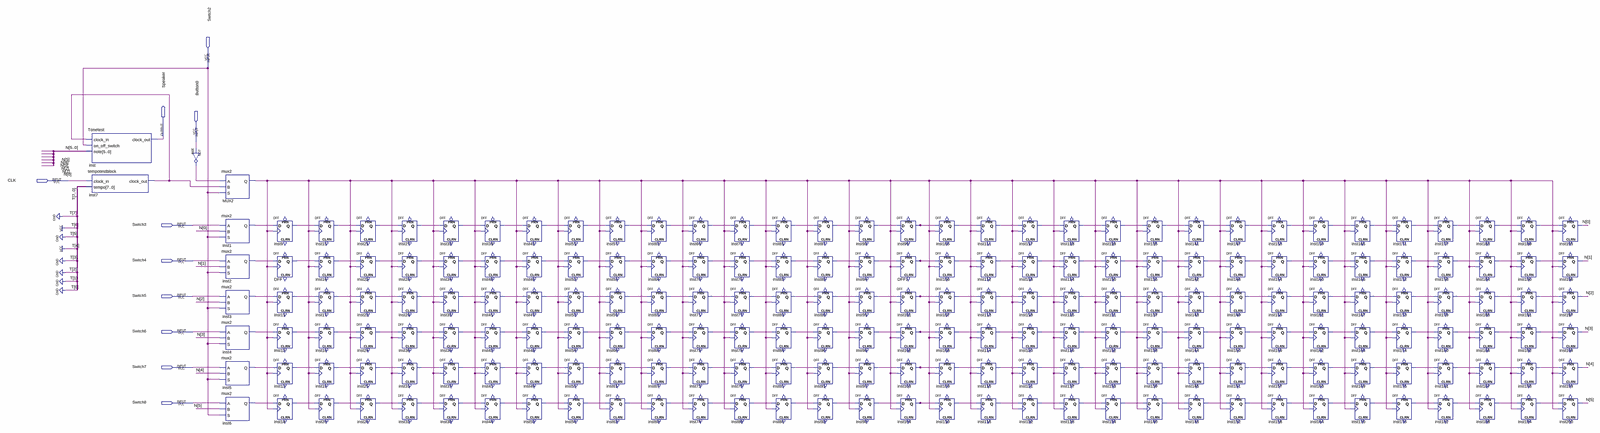
[diagram p0: schematic sheet, whole]
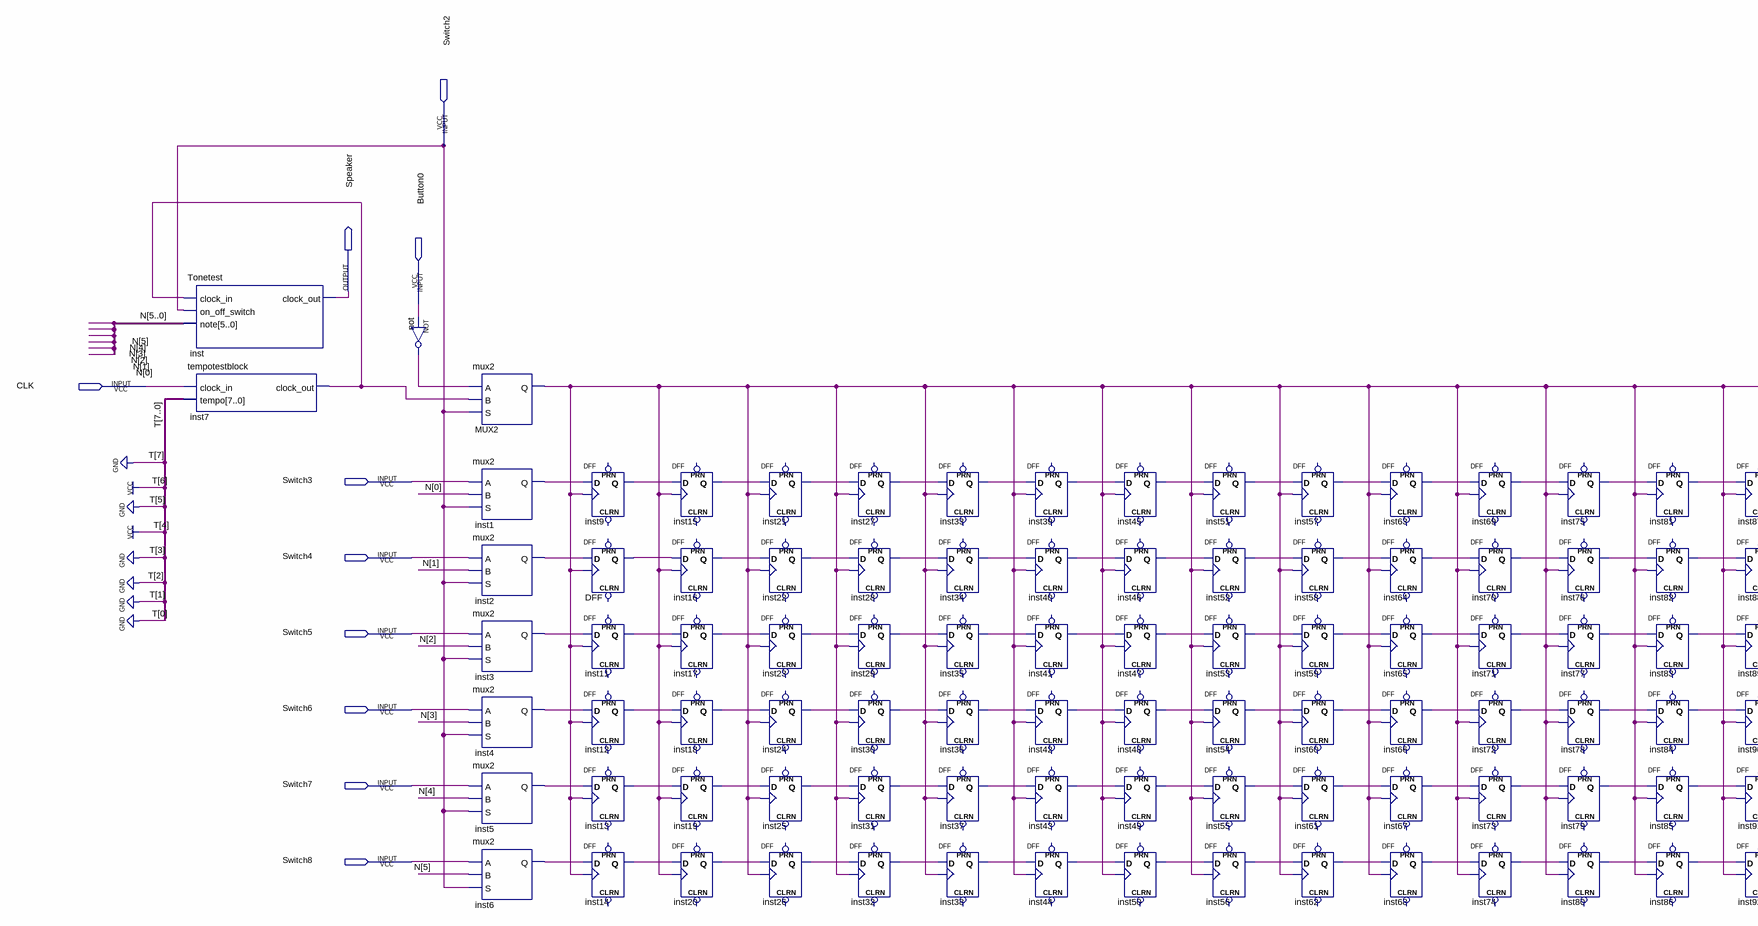
[diagram p1: schematic sheet, left part]
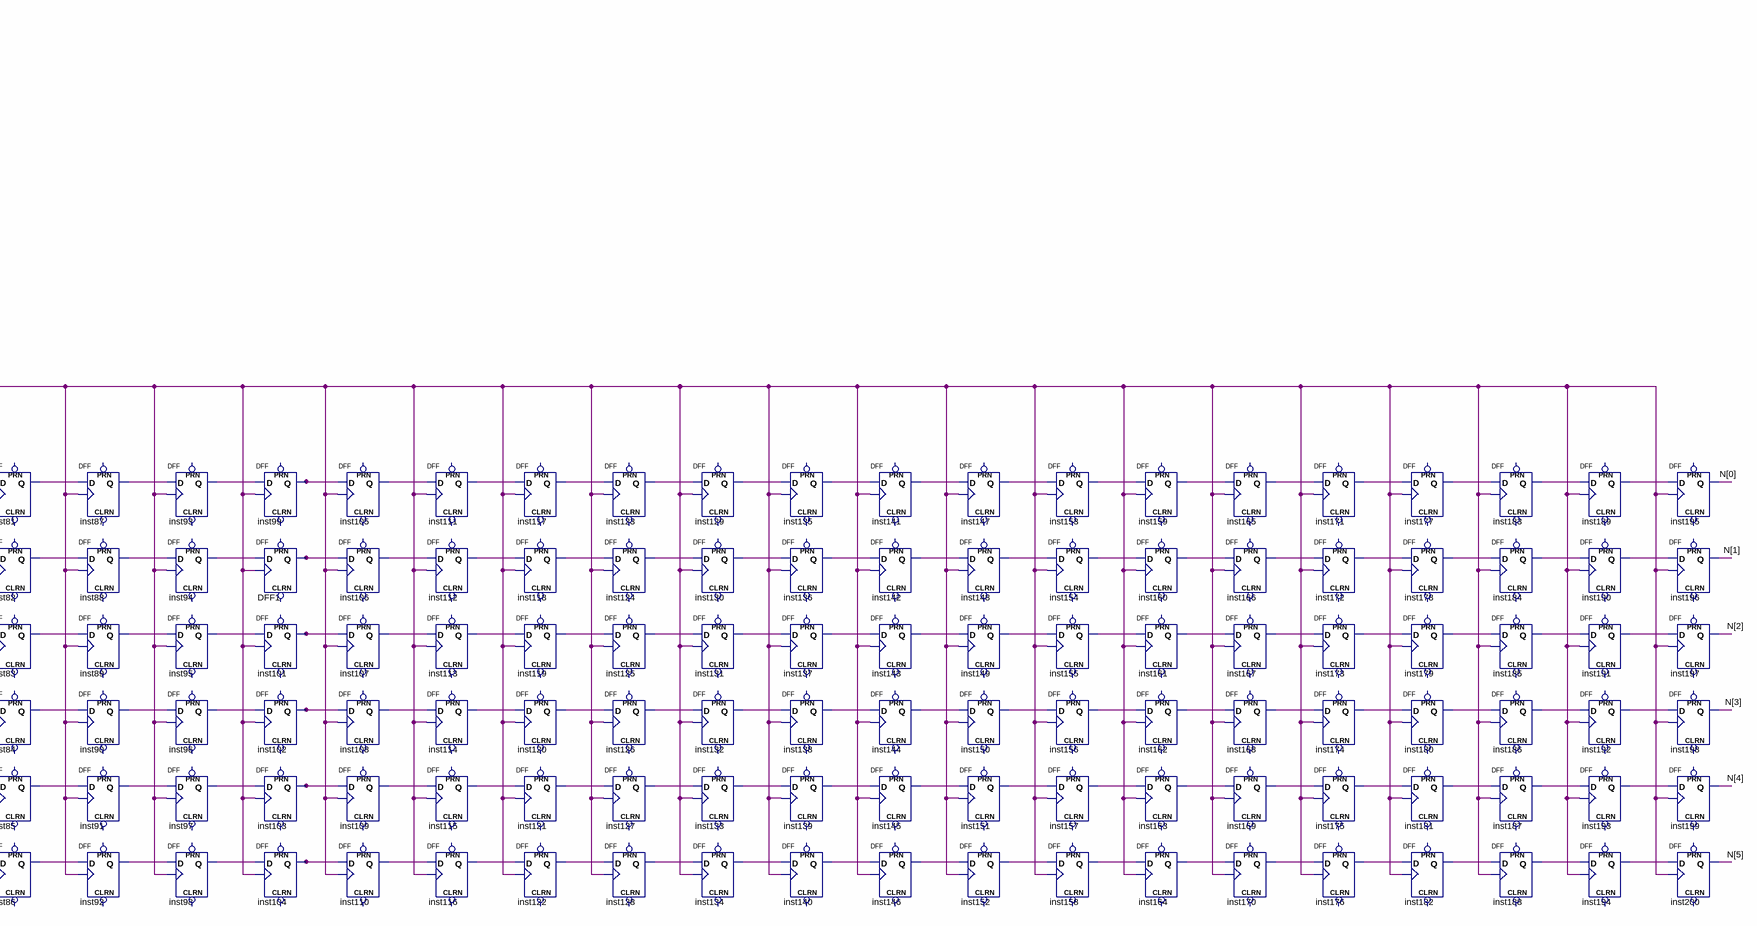
[diagram p2: schematic sheet, right part]
// Quartus schematic musicPlayer.bdf as structural Verilog: 202 symbols, 10 pins
module musicPlayer (
  input  Switch2,
  input  Button0,
  input  CLK,
  input  Switch3,
  input  Switch4,
  input  Switch5,
  input  Switch6,
  input  Switch7,
  input  Switch8,
  output Speaker
);

  wire DFF1_q, DFF_q, inst1_q, inst2_q, inst3_q, inst4_q, inst5_q, inst6_q, inst7_clock_out, inst9_q,
       inst11_q, inst12_q, inst13_q, inst14_q, inst15_q, inst16_q, inst17_q, inst18_q, inst19_q, inst20_q,
       inst21_q, inst22_q, inst23_q, inst24_q, inst25_q, inst26_q, inst27_q, inst28_q, inst29_q, inst30_q,
       inst31_q, inst32_q, inst33_q, inst34_q, inst35_q, inst36_q, inst37_q, inst38_q, inst39_q, inst40_q,
       inst41_q, inst42_q, inst43_q, inst44_q, inst45_q, inst46_q, inst47_q, inst48_q, inst49_q, inst50_q,
       inst51_q, inst52_q, inst53_q, inst54_q, inst55_q, inst56_q, inst57_q, inst58_q, inst59_q, inst60_q,
       inst61_q, inst62_q, inst63_q, inst64_q, inst65_q, inst66_q, inst67_q, inst68_q, inst69_q, inst70_q,
       inst71_q, inst72_q, inst73_q, inst74_q, inst75_q, inst76_q, inst77_q, inst78_q, inst79_q, inst80_q,
       inst81_q, inst82_q, inst83_q, inst84_q, inst85_q, inst86_q, inst87_q, inst88_q, inst89_q, inst90_q,
       inst91_q, inst92_q, inst93_q, inst94_q, inst95_q, inst96_q, inst97_q, inst98_q, inst99_q, inst101_q,
       inst102_q, inst103_q, inst104_q, inst105_q, inst106_q, inst107_q, inst108_q, inst109_q, inst110_q,
       inst111_q, inst112_q, inst113_q, inst114_q, inst115_q, inst116_q, inst117_q, inst118_q, inst119_q,
       inst120_q, inst121_q, inst122_q, inst123_q, inst124_q, inst125_q, inst126_q, inst127_q, inst128_q,
       inst129_q, inst130_q, inst131_q, inst132_q, inst133_q, inst134_q, inst135_q, inst136_q, inst137_q,
       inst138_q, inst139_q, inst140_q, inst141_q, inst142_q, inst143_q, inst144_q, inst145_q, inst146_q,
       inst147_q, inst148_q, inst149_q, inst150_q, inst151_q, inst152_q, inst153_q, inst154_q, inst155_q,
       inst156_q, inst157_q, inst158_q, inst159_q, inst160_q, inst161_q, inst162_q, inst163_q, inst164_q,
       inst165_q, inst166_q, inst167_q, inst168_q, inst169_q, inst170_q, inst171_q, inst172_q, inst173_q,
       inst174_q, inst175_q, inst176_q, inst177_q, inst178_q, inst179_q, inst180_q, inst181_q, inst182_q,
       inst183_q, inst184_q, inst185_q, inst186_q, inst187_q, inst188_q, inst189_q, inst190_q, inst191_q,
       inst192_q, inst193_q, inst194_q, MUX2_q, not_out;
  wire [5:0] N;

  Tonetest inst (.clock_in(inst7_clock_out), .on_off_switch(Switch2), .note(N), .clock_out(Speaker));
  tempotestblock inst7 (.clock_in(CLK), .tempo(8'b01010000), .clock_out(inst7_clock_out));
  not \not  (not_out, Button0);
  mux2 MUX2 (.A(not_out), .B(inst7_clock_out), .S(Switch2), .Q(MUX2_q));
  mux2 inst1 (.A(Switch3), .B(N[0]), .S(Switch2), .Q(inst1_q));
  mux2 inst2 (.A(Switch4), .B(N[1]), .S(Switch2), .Q(inst2_q));
  mux2 inst3 (.A(Switch5), .B(N[2]), .S(Switch2), .Q(inst3_q));
  mux2 inst4 (.A(Switch6), .B(N[3]), .S(Switch2), .Q(inst4_q));
  mux2 inst5 (.A(Switch7), .B(N[4]), .S(Switch2), .Q(inst5_q));
  mux2 inst6 (.A(Switch8), .B(N[5]), .S(Switch2), .Q(inst6_q));
  DFF inst9 (.CLK(MUX2_q), .D(inst1_q), .Q(inst9_q));  // open: CLRN, PRN
  DFF DFF (.CLK(MUX2_q), .D(inst2_q), .Q(DFF_q));  // open: CLRN, PRN
  DFF inst11 (.CLK(MUX2_q), .D(inst3_q), .Q(inst11_q));  // open: CLRN, PRN
  DFF inst12 (.CLK(MUX2_q), .D(inst4_q), .Q(inst12_q));  // open: CLRN, PRN
  DFF inst13 (.CLK(MUX2_q), .D(inst5_q), .Q(inst13_q));  // open: CLRN, PRN
  DFF inst14 (.CLK(MUX2_q), .D(inst6_q), .Q(inst14_q));  // open: CLRN, PRN
  DFF inst15 (.CLK(MUX2_q), .D(inst9_q), .Q(inst15_q));  // open: CLRN, PRN
  DFF inst16 (.CLK(MUX2_q), .D(DFF_q), .Q(inst16_q));  // open: CLRN, PRN
  DFF inst17 (.CLK(MUX2_q), .D(inst11_q), .Q(inst17_q));  // open: CLRN, PRN
  DFF inst18 (.CLK(MUX2_q), .D(inst12_q), .Q(inst18_q));  // open: CLRN, PRN
  DFF inst19 (.CLK(MUX2_q), .D(inst13_q), .Q(inst19_q));  // open: CLRN, PRN
  DFF inst20 (.CLK(MUX2_q), .D(inst14_q), .Q(inst20_q));  // open: CLRN, PRN
  DFF inst21 (.CLK(MUX2_q), .D(inst15_q), .Q(inst21_q));  // open: CLRN, PRN
  DFF inst22 (.CLK(MUX2_q), .D(inst16_q), .Q(inst22_q));  // open: CLRN, PRN
  DFF inst23 (.CLK(MUX2_q), .D(inst17_q), .Q(inst23_q));  // open: CLRN, PRN
  DFF inst24 (.CLK(MUX2_q), .D(inst18_q), .Q(inst24_q));  // open: CLRN, PRN
  DFF inst25 (.CLK(MUX2_q), .D(inst19_q), .Q(inst25_q));  // open: CLRN, PRN
  DFF inst26 (.CLK(MUX2_q), .D(inst20_q), .Q(inst26_q));  // open: CLRN, PRN
  DFF inst27 (.CLK(MUX2_q), .D(inst21_q), .Q(inst27_q));  // open: CLRN, PRN
  DFF inst28 (.CLK(MUX2_q), .D(inst22_q), .Q(inst28_q));  // open: CLRN, PRN
  DFF inst29 (.CLK(MUX2_q), .D(inst23_q), .Q(inst29_q));  // open: CLRN, PRN
  DFF inst30 (.CLK(MUX2_q), .D(inst24_q), .Q(inst30_q));  // open: CLRN, PRN
  DFF inst31 (.CLK(MUX2_q), .D(inst25_q), .Q(inst31_q));  // open: CLRN, PRN
  DFF inst32 (.CLK(MUX2_q), .D(inst26_q), .Q(inst32_q));  // open: CLRN, PRN
  DFF inst33 (.CLK(MUX2_q), .D(inst27_q), .Q(inst33_q));  // open: CLRN, PRN
  DFF inst34 (.CLK(MUX2_q), .D(inst28_q), .Q(inst34_q));  // open: CLRN, PRN
  DFF inst35 (.CLK(MUX2_q), .D(inst29_q), .Q(inst35_q));  // open: CLRN, PRN
  DFF inst36 (.CLK(MUX2_q), .D(inst30_q), .Q(inst36_q));  // open: CLRN, PRN
  DFF inst37 (.CLK(MUX2_q), .D(inst31_q), .Q(inst37_q));  // open: CLRN, PRN
  DFF inst38 (.CLK(MUX2_q), .D(inst32_q), .Q(inst38_q));  // open: CLRN, PRN
  DFF inst39 (.CLK(MUX2_q), .D(inst33_q), .Q(inst39_q));  // open: CLRN, PRN
  DFF inst40 (.CLK(MUX2_q), .D(inst34_q), .Q(inst40_q));  // open: CLRN, PRN
  DFF inst41 (.CLK(MUX2_q), .D(inst35_q), .Q(inst41_q));  // open: CLRN, PRN
  DFF inst42 (.CLK(MUX2_q), .D(inst36_q), .Q(inst42_q));  // open: CLRN, PRN
  DFF inst43 (.CLK(MUX2_q), .D(inst37_q), .Q(inst43_q));  // open: CLRN, PRN
  DFF inst44 (.CLK(MUX2_q), .D(inst38_q), .Q(inst44_q));  // open: CLRN, PRN
  DFF inst45 (.CLK(MUX2_q), .D(inst39_q), .Q(inst45_q));  // open: CLRN, PRN
  DFF inst46 (.CLK(MUX2_q), .D(inst40_q), .Q(inst46_q));  // open: CLRN, PRN
  DFF inst47 (.CLK(MUX2_q), .D(inst41_q), .Q(inst47_q));  // open: CLRN, PRN
  DFF inst48 (.CLK(MUX2_q), .D(inst42_q), .Q(inst48_q));  // open: CLRN, PRN
  DFF inst49 (.CLK(MUX2_q), .D(inst43_q), .Q(inst49_q));  // open: CLRN, PRN
  DFF inst50 (.CLK(MUX2_q), .D(inst44_q), .Q(inst50_q));  // open: CLRN, PRN
  DFF inst51 (.CLK(MUX2_q), .D(inst45_q), .Q(inst51_q));  // open: CLRN, PRN
  DFF inst52 (.CLK(MUX2_q), .D(inst46_q), .Q(inst52_q));  // open: CLRN, PRN
  DFF inst53 (.CLK(MUX2_q), .D(inst47_q), .Q(inst53_q));  // open: CLRN, PRN
  DFF inst54 (.CLK(MUX2_q), .D(inst48_q), .Q(inst54_q));  // open: CLRN, PRN
  DFF inst55 (.CLK(MUX2_q), .D(inst49_q), .Q(inst55_q));  // open: CLRN, PRN
  DFF inst56 (.CLK(MUX2_q), .D(inst50_q), .Q(inst56_q));  // open: CLRN, PRN
  DFF inst57 (.CLK(MUX2_q), .D(inst51_q), .Q(inst57_q));  // open: CLRN, PRN
  DFF inst58 (.CLK(MUX2_q), .D(inst52_q), .Q(inst58_q));  // open: CLRN, PRN
  DFF inst59 (.CLK(MUX2_q), .D(inst53_q), .Q(inst59_q));  // open: CLRN, PRN
  DFF inst60 (.CLK(MUX2_q), .D(inst54_q), .Q(inst60_q));  // open: CLRN, PRN
  DFF inst61 (.CLK(MUX2_q), .D(inst55_q), .Q(inst61_q));  // open: CLRN, PRN
  DFF inst62 (.CLK(MUX2_q), .D(inst56_q), .Q(inst62_q));  // open: CLRN, PRN
  DFF inst63 (.CLK(MUX2_q), .D(inst57_q), .Q(inst63_q));  // open: CLRN, PRN
  DFF inst64 (.CLK(MUX2_q), .D(inst58_q), .Q(inst64_q));  // open: CLRN, PRN
  DFF inst65 (.CLK(MUX2_q), .D(inst59_q), .Q(inst65_q));  // open: CLRN, PRN
  DFF inst66 (.CLK(MUX2_q), .D(inst60_q), .Q(inst66_q));  // open: CLRN, PRN
  DFF inst67 (.CLK(MUX2_q), .D(inst61_q), .Q(inst67_q));  // open: CLRN, PRN
  DFF inst68 (.CLK(MUX2_q), .D(inst62_q), .Q(inst68_q));  // open: CLRN, PRN
  DFF inst69 (.CLK(MUX2_q), .D(inst63_q), .Q(inst69_q));  // open: CLRN, PRN
  DFF inst70 (.CLK(MUX2_q), .D(inst64_q), .Q(inst70_q));  // open: CLRN, PRN
  DFF inst71 (.CLK(MUX2_q), .D(inst65_q), .Q(inst71_q));  // open: CLRN, PRN
  DFF inst72 (.CLK(MUX2_q), .D(inst66_q), .Q(inst72_q));  // open: CLRN, PRN
  DFF inst73 (.CLK(MUX2_q), .D(inst67_q), .Q(inst73_q));  // open: CLRN, PRN
  DFF inst74 (.CLK(MUX2_q), .D(inst68_q), .Q(inst74_q));  // open: CLRN, PRN
  DFF inst75 (.CLK(MUX2_q), .D(inst69_q), .Q(inst75_q));  // open: CLRN, PRN
  DFF inst76 (.CLK(MUX2_q), .D(inst70_q), .Q(inst76_q));  // open: CLRN, PRN
  DFF inst77 (.CLK(MUX2_q), .D(inst71_q), .Q(inst77_q));  // open: CLRN, PRN
  DFF inst78 (.CLK(MUX2_q), .D(inst72_q), .Q(inst78_q));  // open: CLRN, PRN
  DFF inst79 (.CLK(MUX2_q), .D(inst73_q), .Q(inst79_q));  // open: CLRN, PRN
  DFF inst80 (.CLK(MUX2_q), .D(inst74_q), .Q(inst80_q));  // open: CLRN, PRN
  DFF inst81 (.CLK(MUX2_q), .D(inst75_q), .Q(inst81_q));  // open: CLRN, PRN
  DFF inst82 (.CLK(MUX2_q), .D(inst76_q), .Q(inst82_q));  // open: CLRN, PRN
  DFF inst83 (.CLK(MUX2_q), .D(inst77_q), .Q(inst83_q));  // open: CLRN, PRN
  DFF inst84 (.CLK(MUX2_q), .D(inst78_q), .Q(inst84_q));  // open: CLRN, PRN
  DFF inst85 (.CLK(MUX2_q), .D(inst79_q), .Q(inst85_q));  // open: CLRN, PRN
  DFF inst86 (.CLK(MUX2_q), .D(inst80_q), .Q(inst86_q));  // open: CLRN, PRN
  DFF inst87 (.CLK(MUX2_q), .D(inst81_q), .Q(inst87_q));  // open: CLRN, PRN
  DFF inst88 (.CLK(MUX2_q), .D(inst82_q), .Q(inst88_q));  // open: CLRN, PRN
  DFF inst89 (.CLK(MUX2_q), .D(inst83_q), .Q(inst89_q));  // open: CLRN, PRN
  DFF inst90 (.CLK(MUX2_q), .D(inst84_q), .Q(inst90_q));  // open: CLRN, PRN
  DFF inst91 (.CLK(MUX2_q), .D(inst85_q), .Q(inst91_q));  // open: CLRN, PRN
  DFF inst92 (.CLK(MUX2_q), .D(inst86_q), .Q(inst92_q));  // open: CLRN, PRN
  DFF inst93 (.CLK(MUX2_q), .D(inst87_q), .Q(inst93_q));  // open: CLRN, PRN
  DFF inst94 (.CLK(MUX2_q), .D(inst88_q), .Q(inst94_q));  // open: CLRN, PRN
  DFF inst95 (.CLK(MUX2_q), .D(inst89_q), .Q(inst95_q));  // open: CLRN, PRN
  DFF inst96 (.CLK(MUX2_q), .D(inst90_q), .Q(inst96_q));  // open: CLRN, PRN
  DFF inst97 (.CLK(MUX2_q), .D(inst91_q), .Q(inst97_q));  // open: CLRN, PRN
  DFF inst98 (.CLK(MUX2_q), .D(inst92_q), .Q(inst98_q));  // open: CLRN, PRN
  DFF inst99 (.CLK(MUX2_q), .D(inst93_q), .Q(inst99_q));  // open: CLRN, PRN
  DFF DFF1 (.CLK(MUX2_q), .D(inst94_q), .Q(DFF1_q));  // open: CLRN, PRN
  DFF inst101 (.CLK(MUX2_q), .D(inst95_q), .Q(inst101_q));  // open: CLRN, PRN
  DFF inst102 (.CLK(MUX2_q), .D(inst96_q), .Q(inst102_q));  // open: CLRN, PRN
  DFF inst103 (.CLK(MUX2_q), .D(inst97_q), .Q(inst103_q));  // open: CLRN, PRN
  DFF inst104 (.CLK(MUX2_q), .D(inst98_q), .Q(inst104_q));  // open: CLRN, PRN
  DFF inst105 (.CLK(MUX2_q), .D(inst99_q), .Q(inst105_q));  // open: CLRN, PRN
  DFF inst106 (.CLK(MUX2_q), .D(DFF1_q), .Q(inst106_q));  // open: CLRN, PRN
  DFF inst107 (.CLK(MUX2_q), .D(inst101_q), .Q(inst107_q));  // open: CLRN, PRN
  DFF inst108 (.CLK(MUX2_q), .D(inst102_q), .Q(inst108_q));  // open: CLRN, PRN
  DFF inst109 (.CLK(MUX2_q), .D(inst103_q), .Q(inst109_q));  // open: CLRN, PRN
  DFF inst110 (.CLK(MUX2_q), .D(inst104_q), .Q(inst110_q));  // open: CLRN, PRN
  DFF inst111 (.CLK(MUX2_q), .D(inst105_q), .Q(inst111_q));  // open: CLRN, PRN
  DFF inst112 (.CLK(MUX2_q), .D(inst106_q), .Q(inst112_q));  // open: CLRN, PRN
  DFF inst113 (.CLK(MUX2_q), .D(inst107_q), .Q(inst113_q));  // open: CLRN, PRN
  DFF inst114 (.CLK(MUX2_q), .D(inst108_q), .Q(inst114_q));  // open: CLRN, PRN
  DFF inst115 (.CLK(MUX2_q), .D(inst109_q), .Q(inst115_q));  // open: CLRN, PRN
  DFF inst116 (.CLK(MUX2_q), .D(inst110_q), .Q(inst116_q));  // open: CLRN, PRN
  DFF inst117 (.CLK(MUX2_q), .D(inst111_q), .Q(inst117_q));  // open: CLRN, PRN
  DFF inst118 (.CLK(MUX2_q), .D(inst112_q), .Q(inst118_q));  // open: CLRN, PRN
  DFF inst119 (.CLK(MUX2_q), .D(inst113_q), .Q(inst119_q));  // open: CLRN, PRN
  DFF inst120 (.CLK(MUX2_q), .D(inst114_q), .Q(inst120_q));  // open: CLRN, PRN
  DFF inst121 (.CLK(MUX2_q), .D(inst115_q), .Q(inst121_q));  // open: CLRN, PRN
  DFF inst122 (.CLK(MUX2_q), .D(inst116_q), .Q(inst122_q));  // open: CLRN, PRN
  DFF inst123 (.CLK(MUX2_q), .D(inst117_q), .Q(inst123_q));  // open: CLRN, PRN
  DFF inst124 (.CLK(MUX2_q), .D(inst118_q), .Q(inst124_q));  // open: CLRN, PRN
  DFF inst125 (.CLK(MUX2_q), .D(inst119_q), .Q(inst125_q));  // open: CLRN, PRN
  DFF inst126 (.CLK(MUX2_q), .D(inst120_q), .Q(inst126_q));  // open: CLRN, PRN
  DFF inst127 (.CLK(MUX2_q), .D(inst121_q), .Q(inst127_q));  // open: CLRN, PRN
  DFF inst128 (.CLK(MUX2_q), .D(inst122_q), .Q(inst128_q));  // open: CLRN, PRN
  DFF inst129 (.CLK(MUX2_q), .D(inst123_q), .Q(inst129_q));  // open: CLRN, PRN
  DFF inst130 (.CLK(MUX2_q), .D(inst124_q), .Q(inst130_q));  // open: CLRN, PRN
  DFF inst131 (.CLK(MUX2_q), .D(inst125_q), .Q(inst131_q));  // open: CLRN, PRN
  DFF inst132 (.CLK(MUX2_q), .D(inst126_q), .Q(inst132_q));  // open: CLRN, PRN
  DFF inst133 (.CLK(MUX2_q), .D(inst127_q), .Q(inst133_q));  // open: CLRN, PRN
  DFF inst134 (.CLK(MUX2_q), .D(inst128_q), .Q(inst134_q));  // open: CLRN, PRN
  DFF inst135 (.CLK(MUX2_q), .D(inst129_q), .Q(inst135_q));  // open: CLRN, PRN
  DFF inst136 (.CLK(MUX2_q), .D(inst130_q), .Q(inst136_q));  // open: CLRN, PRN
  DFF inst137 (.CLK(MUX2_q), .D(inst131_q), .Q(inst137_q));  // open: CLRN, PRN
  DFF inst138 (.CLK(MUX2_q), .D(inst132_q), .Q(inst138_q));  // open: CLRN, PRN
  DFF inst139 (.CLK(MUX2_q), .D(inst133_q), .Q(inst139_q));  // open: CLRN, PRN
  DFF inst140 (.CLK(MUX2_q), .D(inst134_q), .Q(inst140_q));  // open: CLRN, PRN
  DFF inst141 (.CLK(MUX2_q), .D(inst135_q), .Q(inst141_q));  // open: CLRN, PRN
  DFF inst142 (.CLK(MUX2_q), .D(inst136_q), .Q(inst142_q));  // open: CLRN, PRN
  DFF inst143 (.CLK(MUX2_q), .D(inst137_q), .Q(inst143_q));  // open: CLRN, PRN
  DFF inst144 (.CLK(MUX2_q), .D(inst138_q), .Q(inst144_q));  // open: CLRN, PRN
  DFF inst145 (.CLK(MUX2_q), .D(inst139_q), .Q(inst145_q));  // open: CLRN, PRN
  DFF inst146 (.CLK(MUX2_q), .D(inst140_q), .Q(inst146_q));  // open: CLRN, PRN
  DFF inst147 (.CLK(MUX2_q), .D(inst141_q), .Q(inst147_q));  // open: CLRN, PRN
  DFF inst148 (.CLK(MUX2_q), .D(inst142_q), .Q(inst148_q));  // open: CLRN, PRN
  DFF inst149 (.CLK(MUX2_q), .D(inst143_q), .Q(inst149_q));  // open: CLRN, PRN
  DFF inst150 (.CLK(MUX2_q), .D(inst144_q), .Q(inst150_q));  // open: CLRN, PRN
  DFF inst151 (.CLK(MUX2_q), .D(inst145_q), .Q(inst151_q));  // open: CLRN, PRN
  DFF inst152 (.CLK(MUX2_q), .D(inst146_q), .Q(inst152_q));  // open: CLRN, PRN
  DFF inst153 (.CLK(MUX2_q), .D(inst147_q), .Q(inst153_q));  // open: CLRN, PRN
  DFF inst154 (.CLK(MUX2_q), .D(inst148_q), .Q(inst154_q));  // open: CLRN, PRN
  DFF inst155 (.CLK(MUX2_q), .D(inst149_q), .Q(inst155_q));  // open: CLRN, PRN
  DFF inst156 (.CLK(MUX2_q), .D(inst150_q), .Q(inst156_q));  // open: CLRN, PRN
  DFF inst157 (.CLK(MUX2_q), .D(inst151_q), .Q(inst157_q));  // open: CLRN, PRN
  DFF inst158 (.CLK(MUX2_q), .D(inst152_q), .Q(inst158_q));  // open: CLRN, PRN
  DFF inst159 (.CLK(MUX2_q), .D(inst153_q), .Q(inst159_q));  // open: CLRN, PRN
  DFF inst160 (.CLK(MUX2_q), .D(inst154_q), .Q(inst160_q));  // open: CLRN, PRN
  DFF inst161 (.CLK(MUX2_q), .D(inst155_q), .Q(inst161_q));  // open: CLRN, PRN
  DFF inst162 (.CLK(MUX2_q), .D(inst156_q), .Q(inst162_q));  // open: CLRN, PRN
  DFF inst163 (.CLK(MUX2_q), .D(inst157_q), .Q(inst163_q));  // open: CLRN, PRN
  DFF inst164 (.CLK(MUX2_q), .D(inst158_q), .Q(inst164_q));  // open: CLRN, PRN
  DFF inst165 (.CLK(MUX2_q), .D(inst159_q), .Q(inst165_q));  // open: CLRN, PRN
  DFF inst166 (.CLK(MUX2_q), .D(inst160_q), .Q(inst166_q));  // open: CLRN, PRN
  DFF inst167 (.CLK(MUX2_q), .D(inst161_q), .Q(inst167_q));  // open: CLRN, PRN
  DFF inst168 (.CLK(MUX2_q), .D(inst162_q), .Q(inst168_q));  // open: CLRN, PRN
  DFF inst169 (.CLK(MUX2_q), .D(inst163_q), .Q(inst169_q));  // open: CLRN, PRN
  DFF inst170 (.CLK(MUX2_q), .D(inst164_q), .Q(inst170_q));  // open: CLRN, PRN
  DFF inst171 (.CLK(MUX2_q), .D(inst165_q), .Q(inst171_q));  // open: CLRN, PRN
  DFF inst172 (.CLK(MUX2_q), .D(inst166_q), .Q(inst172_q));  // open: CLRN, PRN
  DFF inst173 (.CLK(MUX2_q), .D(inst167_q), .Q(inst173_q));  // open: CLRN, PRN
  DFF inst174 (.CLK(MUX2_q), .D(inst168_q), .Q(inst174_q));  // open: CLRN, PRN
  DFF inst175 (.CLK(MUX2_q), .D(inst169_q), .Q(inst175_q));  // open: CLRN, PRN
  DFF inst176 (.CLK(MUX2_q), .D(inst170_q), .Q(inst176_q));  // open: CLRN, PRN
  DFF inst177 (.CLK(MUX2_q), .D(inst171_q), .Q(inst177_q));  // open: CLRN, PRN
  DFF inst178 (.CLK(MUX2_q), .D(inst172_q), .Q(inst178_q));  // open: CLRN, PRN
  DFF inst179 (.CLK(MUX2_q), .D(inst173_q), .Q(inst179_q));  // open: CLRN, PRN
  DFF inst180 (.CLK(MUX2_q), .D(inst174_q), .Q(inst180_q));  // open: CLRN, PRN
  DFF inst181 (.CLK(MUX2_q), .D(inst175_q), .Q(inst181_q));  // open: CLRN, PRN
  DFF inst182 (.CLK(MUX2_q), .D(inst176_q), .Q(inst182_q));  // open: CLRN, PRN
  DFF inst183 (.CLK(MUX2_q), .D(inst177_q), .Q(inst183_q));  // open: CLRN, PRN
  DFF inst184 (.CLK(MUX2_q), .D(inst178_q), .Q(inst184_q));  // open: CLRN, PRN
  DFF inst185 (.CLK(MUX2_q), .D(inst179_q), .Q(inst185_q));  // open: CLRN, PRN
  DFF inst186 (.CLK(MUX2_q), .D(inst180_q), .Q(inst186_q));  // open: CLRN, PRN
  DFF inst187 (.CLK(MUX2_q), .D(inst181_q), .Q(inst187_q));  // open: CLRN, PRN
  DFF inst188 (.CLK(MUX2_q), .D(inst182_q), .Q(inst188_q));  // open: CLRN, PRN
  DFF inst189 (.CLK(MUX2_q), .D(inst183_q), .Q(inst189_q));  // open: CLRN, PRN
  DFF inst190 (.CLK(MUX2_q), .D(inst184_q), .Q(inst190_q));  // open: CLRN, PRN
  DFF inst191 (.CLK(MUX2_q), .D(inst185_q), .Q(inst191_q));  // open: CLRN, PRN
  DFF inst192 (.CLK(MUX2_q), .D(inst186_q), .Q(inst192_q));  // open: CLRN, PRN
  DFF inst193 (.CLK(MUX2_q), .D(inst187_q), .Q(inst193_q));  // open: CLRN, PRN
  DFF inst194 (.CLK(MUX2_q), .D(inst188_q), .Q(inst194_q));  // open: CLRN, PRN
  DFF inst195 (.CLK(MUX2_q), .D(inst189_q), .Q(N[0]));  // open: CLRN, PRN
  DFF inst196 (.CLK(MUX2_q), .D(inst190_q), .Q(N[1]));  // open: CLRN, PRN
  DFF inst197 (.CLK(MUX2_q), .D(inst191_q), .Q(N[2]));  // open: CLRN, PRN
  DFF inst198 (.CLK(MUX2_q), .D(inst192_q), .Q(N[3]));  // open: CLRN, PRN
  DFF inst199 (.CLK(MUX2_q), .D(inst193_q), .Q(N[4]));  // open: CLRN, PRN
  DFF inst200 (.CLK(MUX2_q), .D(inst194_q), .Q(N[5]));  // open: CLRN, PRN
endmodule
